# EAGLE design PCFX_Mouse_rev_A (EAGLE 9.6.2)
PC Engine Joypad Breakout Version 1.0
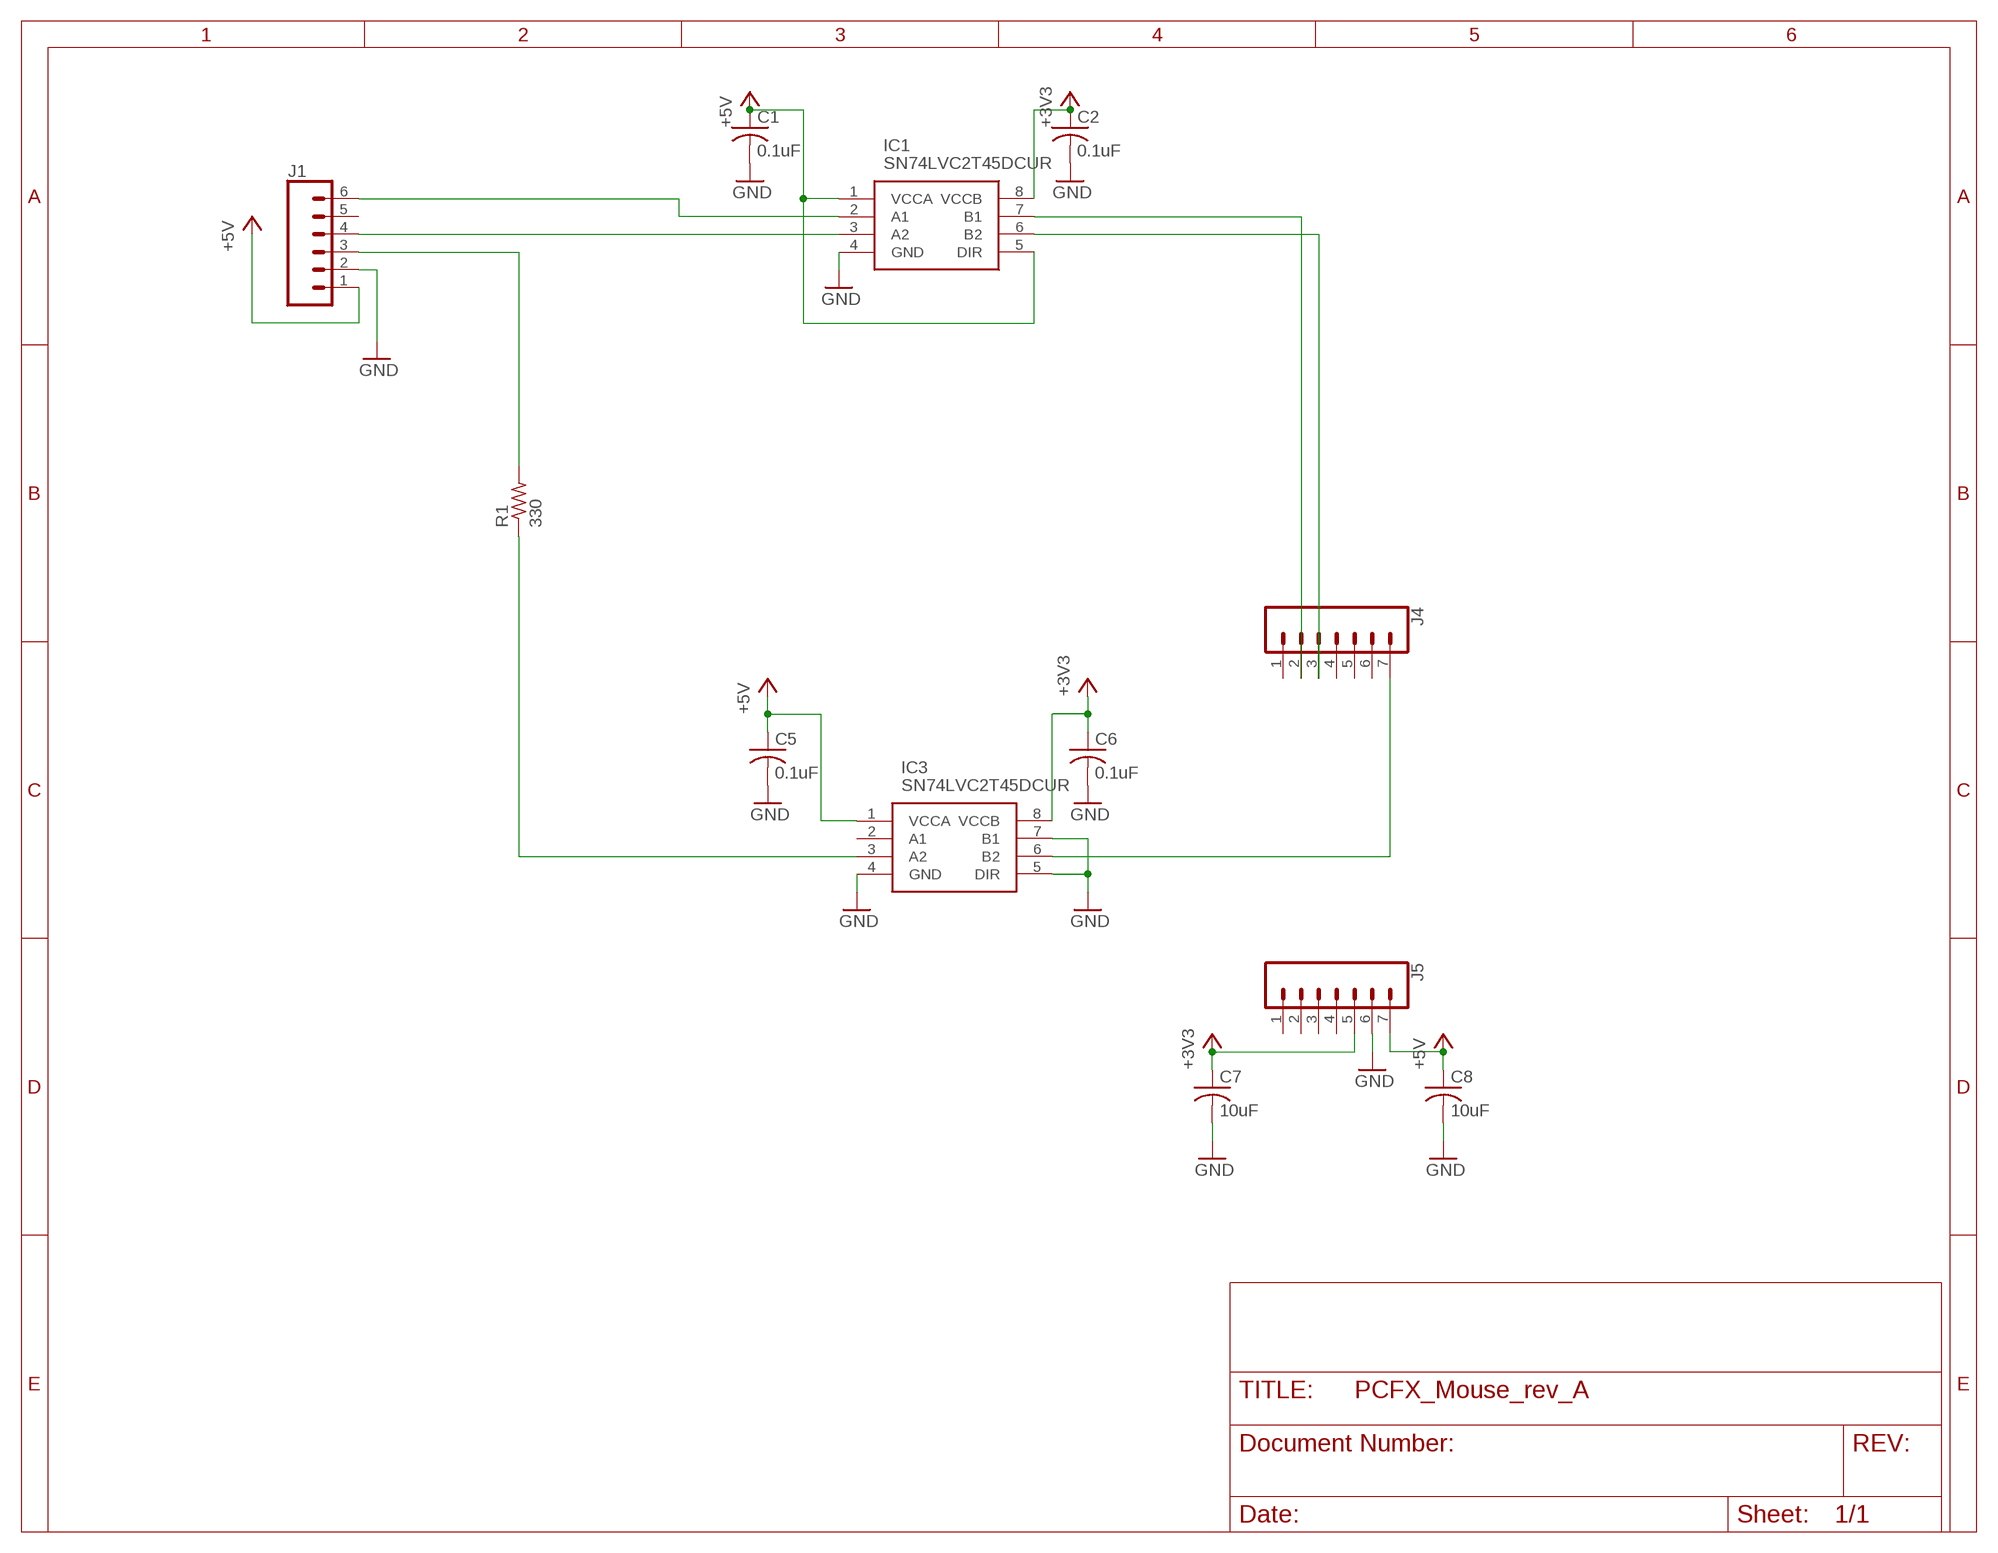
[diagram p0: schematic, sheet 1]

## Parts
C1  0.1uF  C-USC0402  [C0402]
C2  0.1uF  C-USC0402  [C0402]
C5  0.1uF  C-USC0402  [C0402]
C6  0.1uF  C-USC0402  [C0402]
C7  10uF  C-USC0805  [C0805]
C8  10uF  C-USC0805  [C0805]
IC1  SN74LVC2T45DCUR  [SOP50P310X90-8N]
IC3  SN74LVC2T45DCUR  [SOP50P310X90-8N]
J1  CONN_06NO_SILK_FEMALE_PTH  [1X06_NO_SILK]
J4  CONN_07LONGPADS  [1X07_LONGPADS]
J5  CONN_07LONGPADS  [1X07_LONGPADS]
R1  330  R-US_R0402  [R0402]

## Nets
+3V3 [power]: C2.1 C6.1 C7.1 IC1.8(VCCB) IC3.8(VCCB) J5.5
+5V [power]: C1.1 C5.1 C8.1 IC1.1(VCCA) IC1.5(DIR) IC3.1(VCCA) J1.1 J5.7
CLK [signal]: IC1.3(A2) J1.4
DATA: J1.3 R1.2
GND: C1.2 C2.2 C5.2 C6.2 C7.2 C8.2 IC1.4(GND) IC3.4(GND) IC3.5(DIR) IC3.7(B1) J1.2 J5.6
LATCH [signal]: IC1.2(A1) J1.6
N$2: IC1.7(B1) J4.2
N$3: IC3.6(B2) J4.7
N$7: IC1.6(B2) J4.3
N$8: IC3.3(A2) R1.1
Unconnected: IC3.2(A1) J1.5 J4.1 J4.4 J4.5 J4.6 J5.1 J5.2 J5.3 J5.4

## Library data of the parts
C1 C2 C5-C8 = resistor:C-US: CAPACITOR, American symbol
IC1 IC3 = PC-Engine:SN74LVC2T45DCUR: Texas Instruments SN74LVC2T45DCUR, Voltage Level Translator, Bus Transceiver, 3-State, 1.65 5.5 V, 8-Pin UM Source: Datasheet <http://www.ti.com/lit/gpn/sn74lvc2t45>; ARROW_PART_NUMBER: SN74LVC2T45DCUR; ARROW_PRICE-STOCK: https://www.arrow.com/en/products/sn74lvc2t45dcur/texas-instruments?region=nac; DESCRIPTION: Texas Instruments SN74LVC2T45DCUR, Voltage Level Translator, Bus Transceiver, 3-State, 1.65 5.5 V, 8-Pin UM; HEIGHT: 0.9mm; MANUFACTURER_NAME: Texas Instruments; MANUFACTURER_PART_NUMBER: SN74LVC2T45DCUR; MOUSER_PART_NUMBER: 595-SN74LVC2T45DCUR; MOUSER_PRICE-STOCK: https://www.mouser.co.uk/ProductDetail/Texas-Instruments/SN74LVC2T45DCUR?qs=0smPjiIwnfIdG9vxyJHBdA%3D%3D
J1 = SparkFun-Connectors:CONN_06: Multi connection point. Often used as Generic Header-pin footprint for 0.1 inch spaced/style header connections On any of the 0.1 inch spaced packages, you can populate with these: Break Away Headers - Straight <https://www.sparkfun.com/products/116> (PRT-00116) Break Away Male Headers - Right Angle <https://www.sparkfun.com/products/553> (PRT-00553) Female Headers <https://www.sparkfun.com/products/115> (PRT-00115) Break Away Headers - Machine Pin <https://www.sparkfun.com/products/117> (PRT-00117) Break Away Female Headers - Swiss Machine Pin <https://www.sparkfun.com/products/743> (PRT-00743) Arduino Stackable Header - 6 Pin <https://www.sparkfun.com/products/9280> (PRT-09280) For SCREWTERMINALS and SPRING TERMINALS visit here: Screw Terimnals on SparkFun.com <https://www.sparkfun.com/search/results?term=Screw+Terminals> (5mm/3.5mm/2.54mm spacing) This device is also useful as a general connection point to wire up your design to another part of your project. Our various solder wires solder well into these plated through hole pads. Hook-Up Wire - Assortment (Stranded, 22 AWG) <https://www.sparkfun.com/products/11375> (PRT-11375) Hook-Up Wire - Assortment (Solid Core, 22 AWG) <https://www.sparkfun.com/products/11367> (PRT-11367) View the entire wire category on our website here <https://www.sparkfun.com/categories/141>; PROD_ID: CONN-08437
J4 J5 = SparkFun-Connectors:CONN_07: Multi connection point. Often used as Generic Header-pin footprint for 0.1 inch spaced/style header connections On any of the 0.1 inch spaced packages, you can populate with these: Break Away Headers - Straight <https://www.sparkfun.com/products/116> (PRT-00116) Break Away Male Headers - Right Angle <https://www.sparkfun.com/products/553> (PRT-00553) Female Headers <https://www.sparkfun.com/products/115> (PRT-00115) Break Away Headers - Machine Pin <https://www.sparkfun.com/products/117> (PRT-00117) Break Away Female Headers - Swiss Machine Pin <https://www.sparkfun.com/products/743> (PRT-00743) For SCREWTERMINALS and SPRING TERMINALS visit here: Screw Terimnals on SparkFun.com <https://www.sparkfun.com/search/results?term=Screw+Terminals> (5mm/3.5mm/2.54mm spacing) This device is also useful as a general connection point to wire up your design to another part of your project. Our various solder wires solder well into these plated through hole pads. Hook-Up Wire - Assortment (Stranded, 22 AWG) <https://www.sparkfun.com/products/11375> (PRT-11375) Hook-Up Wire - Assortment (Solid Core, 22 AWG) <https://www.sparkfun.com/products/11367> (PRT-11367) View the entire wire category on our website here <https://www.sparkfun.com/categories/141> Special notes: Molex polarized connector foot print use with SKU : PRT-08231 with associated crimp pins and housings. 1MM SMD Version SKU: PRT-10208 NOTES ON THE VARIANTS LOCK and LOCK_LONGPADS... This footprint was designed to help hold the alignment of a through-hole component (i.e. 6-pin header) while soldering it into place. You may notice that each hole has been shifted either up or down by 0.005 of an inch from it's more standard position (which is a perfectly straight line). This slight alteration caused the pins (the squares in the middle) to touch the edges of the holes. Because they are alternating, it causes a "brace" to hold the component in place. 0.005 has proven to be the perfect amount of "off-center" position when using our standard breakaway headers. Although looks a little odd when you look at the bare footprint, once you have a header in there, the alteration is very hard to notice. Also,if you push a header all the way into place, it is covered up entirely on the bottom side.
R1 = resistor:R-US_: RESISTOR, American symbol

## Net classes
0 default: width 0.152 mm, drill 0.356 mm, clearance 0.152 mm
1 power: width 0.305 mm, drill 0.356 mm, clearance 0.152 mm
2 signal: width 0.152 mm, drill 0.356 mm, clearance 0.152 mm

## Board
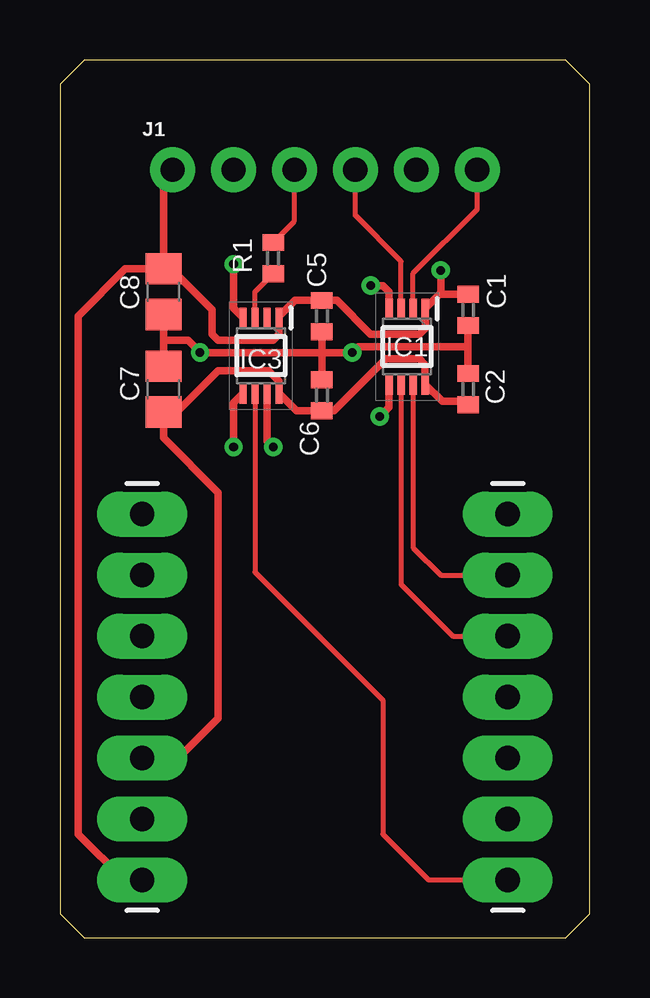
[diagram p1: board, top side]
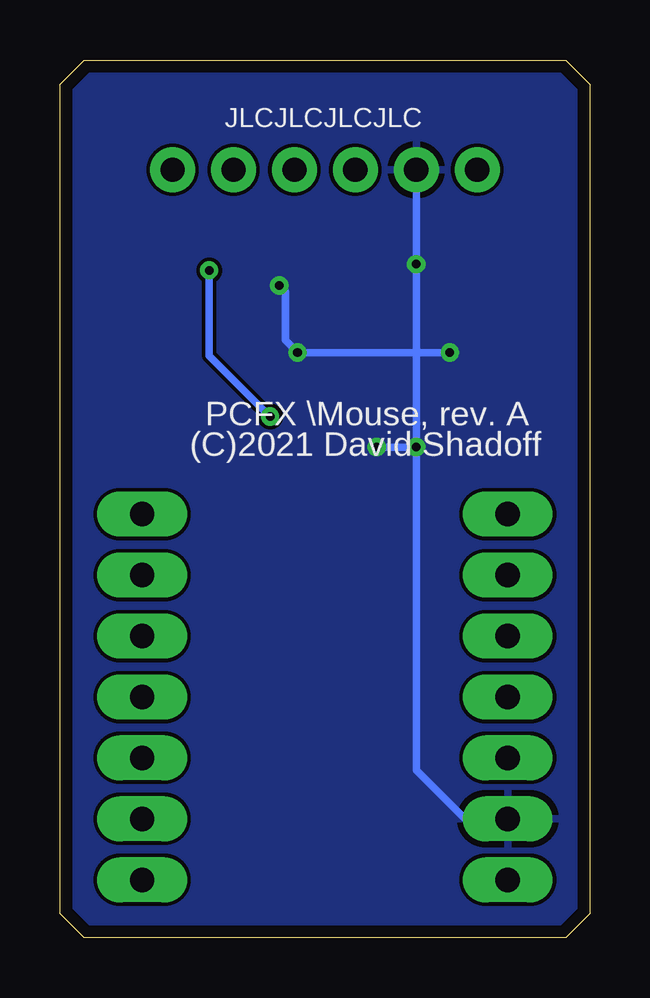
[diagram p2: board, bottom side, seen from below]

Size 22.1 x 36.58 mm. Coordinates in mm from the lower left corner, seen from the top.
Outline: 0,35.58 0,1 1,0 21.1,0 22.1,1 22.1,35.58 21.1,36.58 1,36.58 0,35.58
Copper layers (1*16): Top 0.035mm / dielectric 1.5mm / Bottom 0.035mm
Design rules "default *": minimum track width 6mil, minimum drill 0.35mm, track to track 6mil, track to pad 6mil, pad to pad 6mil, via to via 6mil, smd to smd 6mil, copper to edge 20mil, drill to drill 6mil, minimum pad ring 10mil, minimum via ring 8mil, stop-mask expansion 3mil, vias tented up to drill 18mil, thermal gap 10mil

### Footprints (pad centres in the part's own frame; a part is rotated, then mirrored left to right if it is on the bottom)
C0402 = smd 0.7 x 0.9: 1 -0.65,0; 2 0.65,0
C0805 = smd 1.3 x 1.5: 1 -0.95,0; 2 0.95,0
SOP50P310X90-8N = smd 0.85 x 0.3: 1 -1.575,0.75; 2 -1.575,0.25; 3 -1.575,-0.25; 4 -1.575,-0.75; 5 1.575,-0.75; 6 1.575,-0.25; 7 1.575,0.25; 8 1.575,0.75
1X06_NO_SILK = drill 1.016 pad 1.88: 1 0,0; 2 2.54,0; 3 5.08,0; 4 7.62,0; 5 10.16,0; 6 12.7,0
1X07_LONGPADS = drill 1.016 pad 1.88 long: 1 0,0; 2 2.54,0; 3 5.08,0; 4 7.62,0; 5 10.16,0; 6 12.7,0; 7 15.24,0
R0402 = smd 0.7 x 0.9: 1 -0.65,0; 2 0.65,0

### Placement (x,y rotation side)
C1  17.02,26.16 270 top
C2  17.02,22.86 90 top
C5  10.92,25.91 270 top
C6  10.92,22.61 90 top
C7  4.32,22.86 90 top
C8  4.32,26.92 270 top
IC1  14.48,24.64 270 top
IC3  8.38,24.26 270 top
J1  4.7,32 0 top
J4  18.67,17.65 270 top
J5  3.43,17.65 270 top
R1  8.89,28.32 90 top

### Tracks (layer width: path | path; a pad name or v marks a point on that pad's centre or on a via)
+3V3
  Top 0.305: C2.1 16.88,22.35 15.94,22.35 IC1.8 15.23,23.89 14.99,24.13 13.6,24.13 11.43,21.96 C6.1 9.86,21.96 IC3.8 9.13,23.19 8.7,23.62 6.6,23.62 4.89,21.91 C7.1 4.32,20.83 6.6,18.54 6.6,9.14 4.95,7.49 J5.5
+5V  (via drill 0.36)
  Top 0.305: C8.1 4.64,27.87 6.35,26.16 6.35,25.15 6.6,24.89 8.89,24.89 9.14,25.15 9.14,25.82 IC3.1 9.13,25.9 9.79,26.56 C5.1 11.54,26.56 12.95,25.15 14.99,25.15 15.24,25.4 IC1.1 15.83,26.81 | 15.83,26.81 C1.1 | C8.1 4.32,31.62 J1.1 | C8.1 2.73,27.87 0.76,25.91 0.76,4.32 2.67,2.41 J5.7 | IC1.5 13.73,22.11 v13.34,21.72 | v15.88,27.81 15.88,26.86 15.83,26.81
  Bottom 0.305: v13.34,21.72 15.88,24.26 v15.88,27.81
CLK
  Top 0.203: IC1.3 14.23,28.19 12.32,30.1 J1.4
DATA
  Top 0.203: R1.2 9.39,29.47 9.78,29.86 J1.3
GND  (via drill 0.36)
  Top 0.305: C8.2 4.32,24.89 | 4.32,24.89 C7.2 | C5.2 10.92,24.38 | C6.2 10.92,24.38 | C1.2 17.02,24.64 | 17.02,24.64 C2.2 | 4.32,24.89 5.33,24.89 v5.84,24.38 10.92,24.38 | 10.92,24.38 v12.19,24.38 12.45,24.64 17.02,24.64 | IC3.4 7.24,26.23 v7.24,28.07 | v7.24,20.45 7.24,22.29 IC3.5 | IC3.7 8.64,20.7 v8.89,20.45 | v12.95,27.18 13.46,27.18 13.73,26.91 IC1.4
  Bottom 0.305: J1.2 v7.24,28.07 7.24,24.38 | v7.24,20.45 7.24,6.99 5.21,4.95 J5.6 | v7.24,20.45 7.24,24.38 | 7.24,24.38 v5.84,24.38 | 7.24,24.38 v12.19,24.38 12.7,24.89 12.7,26.92 v12.95,27.18 | v7.24,20.45 v8.89,20.45
  pour Bottom: -0.64,-0.51 -0.64,37.08 22.86,37.08 22.86,-0.51
LATCH
  Top 0.203: IC1.2 14.73,27.68 17.4,30.35 J1.6
N$2
  Top 0.203: IC1.7 14.73,16.26 15.88,15.11 J4.2
N$3
  Top 0.203: IC3.6 8.13,15.24 13.46,9.91 13.46,4.32 15.37,2.41 J4.7
N$7
  Top 0.203: IC1.6 14.23,14.73 16.38,12.57 J4.3
N$8
  Top 0.203: IC3.3 8.13,26.91 R1.1

### Text on the board
bNames: JLCJLCJLCJLC | PCFX \Mouse, rev. A | (C)2021 David Shadoff